# Altium schematic sheet levelshift5_12.SchDoc
size A; Organization: Cal Poly Racing; engineer1: who?
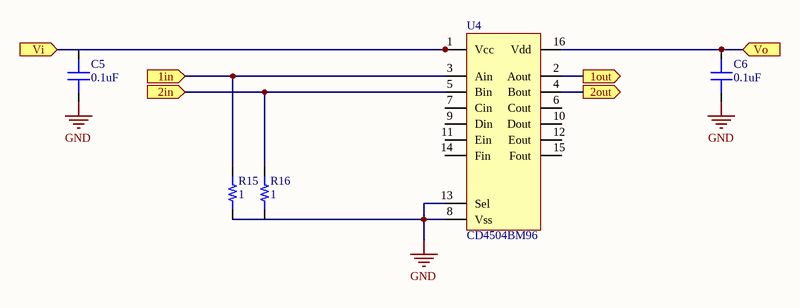
[diagram p0: levelshift5_12.SchDoc]

## Parts
C5  capacitance: 0.1uF  [0603]  (hidden comment: capacitor)
C6  capacitance: 0.1uF  [0603]  (hidden comment: capacitor)
R15  1  [RES 0603/1608]
R16  1  [RES 0603/1608]
U4  CD4504BM96  [SOIC-16]

## Ports
1in (in), 1out (out), 2in (in), 2out (out), Vi (in), Vo (in)

## Nets
GND: C5.1 C6.1 R15.1 R16.1 U4.8(Vss) U4.13(Sel)
1in: R15.2 U4.3(Ain) ; port 1in
1out: U4.2(Aout) ; port 1out
2in: R16.2 U4.5(Bin) ; port 2in
2out: U4.4(Bout) ; port 2out
Vi: C5.2 U4.1(Vcc) ; port Vi
Vo: C6.2 U4.16(Vdd) ; port Vo

Not connected (* = marked no-connect by the designer): U4 6(Cout) 7(Cin) 9(Din) 10(Dout) 11(Ein) 12(Eout) 14(Fin) 15(Fout)

## Notes on the sheet
- Date:
- Time:
- File:

## Library data of the parts
C5 C6 = 1: Generic 0603 capacitor; id: 1
R15 R16 = 1: name: 0603 Resistor; percent tolerance: 5; id: 1; resistance: 1; package: 0603; quantity: 0
U4 = 1: Voltage Level Translator Unidirectional 1 Cir; id: 1; Vcc: 20; Name: CD4504BM96; type: Level shifter CMOS-CMOS; package: SOIC-16; quantity: 0; link: https://www.digikey.com/product-detail/en/texas-instruments/CD4504BM96/296-14150-2-ND/525968